# Altium schematic sheet NCS_Wireless_Control_Card_hc12_display_conn.SchDoc
size A
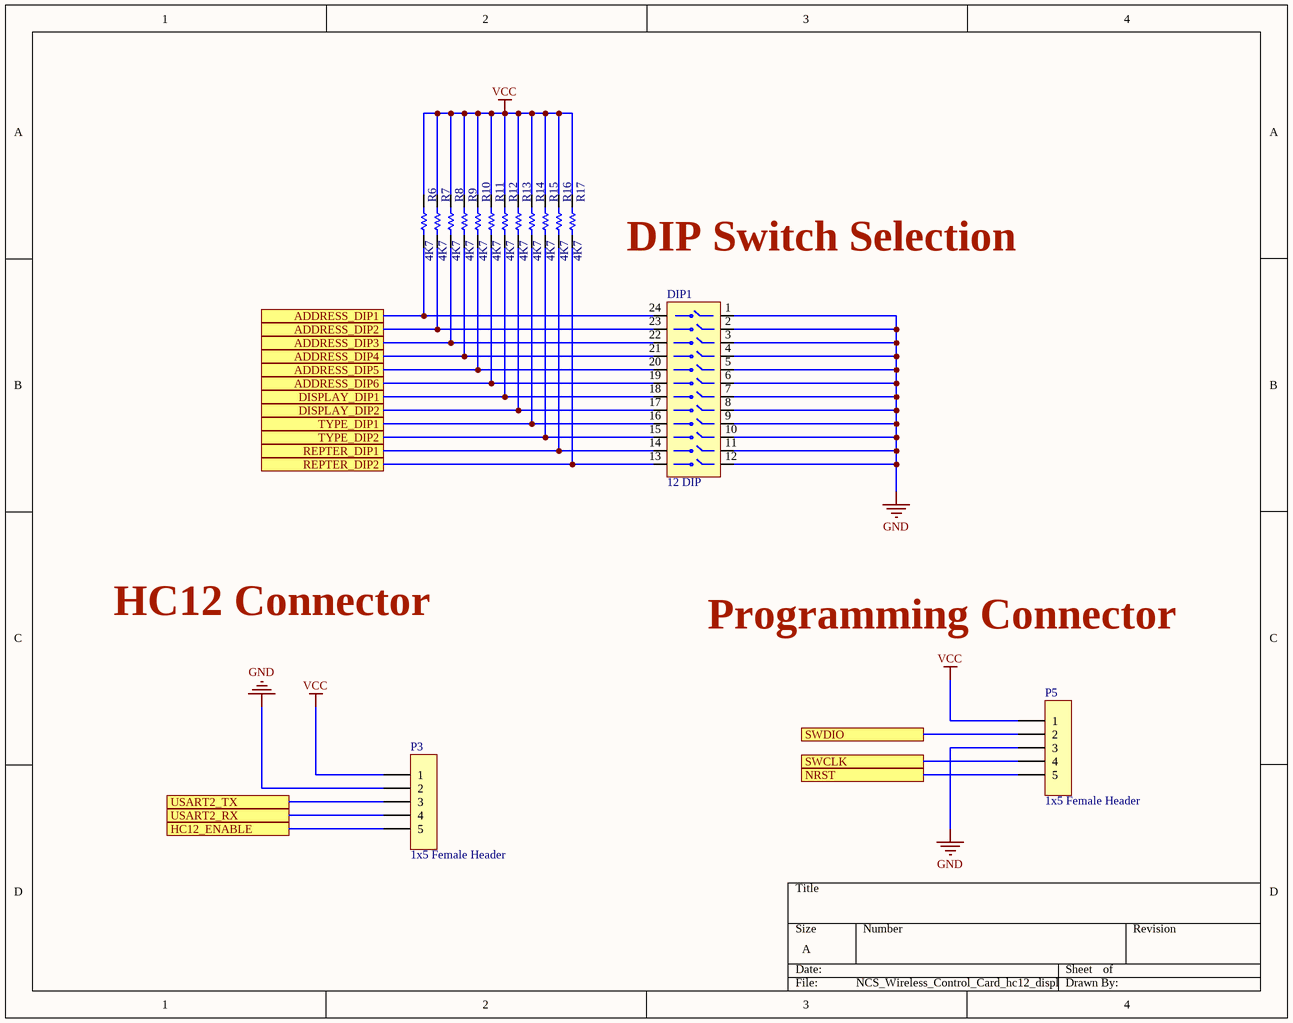
[diagram p0: NCS_Wireless_Control_Card_hc12_display_conn.SchDoc]

## Parts
DIP1  12 DIP  [DIP24]
P3  1x5 Female Header  [1x5 Female Header]
P5  1x5 Female Header  [1x5 Female Header]
R6  4K7  [RC0805FR-7W330RL]
R7  4K7  [RC0805FR-7W330RL]
R8  4K7  [RC0805FR-7W330RL]
R9  4K7  [RC0805FR-7W330RL]
R10  4K7  [RC0805FR-7W330RL]
R11  4K7  [RC0805FR-7W330RL]
R12  4K7  [RC0805FR-7W330RL]
R13  4K7  [RC0805FR-7W330RL]
R14  4K7  [RC0805FR-7W330RL]
R15  4K7  [RC0805FR-7W330RL]
R16  4K7  [RC0805FR-7W330RL]
R17  4K7  [RC0805FR-7W330RL]

## Ports
ADDRESS_DIP1, ADDRESS_DIP2, ADDRESS_DIP3, ADDRESS_DIP4, ADDRESS_DIP5, ADDRESS_DIP6, DISPLAY_DIP1, DISPLAY_DIP2, HC12_ENABLE, NRST, REPTER_DIP1, REPTER_DIP2, SWCLK, SWDIO, TYPE_DIP1, TYPE_DIP2, USART2_RX, USART2_TX

## Nets
GND: DIP1.1 DIP1.2 DIP1.3 DIP1.4 DIP1.5 DIP1.6 DIP1.7 DIP1.8 DIP1.9 DIP1.10 DIP1.11 DIP1.12 P3.2 P5.3
VCC: P3.1 P5.1 R6.2 R7.2 R8.2 R9.2 R10.2 R11.2 R12.2 R13.2 R14.2 R15.2 R16.2 R17.2
ADDRESS_DIP1: DIP1.24 R6.1 ; port ADDRESS_DIP1
ADDRESS_DIP2: DIP1.23 R7.1 ; port ADDRESS_DIP2
ADDRESS_DIP3: DIP1.22 R8.1 ; port ADDRESS_DIP3
ADDRESS_DIP4: DIP1.21 R9.1 ; port ADDRESS_DIP4
ADDRESS_DIP5: DIP1.20 R10.1 ; port ADDRESS_DIP5
ADDRESS_DIP6: DIP1.19 R11.1 ; port ADDRESS_DIP6
DISPLAY_DIP1: DIP1.18 R12.1 ; port DISPLAY_DIP1
DISPLAY_DIP2: DIP1.17 R13.1 ; port DISPLAY_DIP2
HC12_ENABLE: P3.5 ; port HC12_ENABLE
NRST: P5.5 ; port NRST
REPTER_DIP1: DIP1.14 R16.1 ; port REPTER_DIP1
REPTER_DIP2: DIP1.13 R17.1 ; port REPTER_DIP2
SWCLK: P5.4 ; port SWCLK
SWDIO: P5.2 ; port SWDIO
TYPE_DIP1: DIP1.16 R14.1 ; port TYPE_DIP1
TYPE_DIP2: DIP1.15 R15.1 ; port TYPE_DIP2
USART2_RX: P3.4 ; port USART2_RX
USART2_TX: P3.3 ; port USART2_TX

## Notes on the sheet
- DIP Switch Selection
- HC12 Connector
- Programming Connector

## Library data of the parts
DIP1 = 12 Way 2.54MM DIP switch - SUNROM
P3 P5 = M20-9990546: 2.54mm (0.1) Pitch SIL Vertical PC Tail Pin Header, 6.1mm mating pin height, tin, 5 contacts"; Manufacturer: Harwin; Number of Contacts: 5; Current Rating: 3A; Gender: Male; Insulation Resistance: 10GR; Voltage Rating (DC): 750V; Mated Stacking Heights: 16.54mm; Supplier: Digikey; Supplier Part Number: 952-2268-ND; Manufacturer Part Number: M20-9990546; RoHS: Yes; Category: Headers and Wire Housings; Stock: 16218; Pricing: 1=0.2, 10=0.163, 100=0.1329, 500=0.11516, 1000=0.10828, 5000=0.09388, 10000=0.08828 (USD); Mounting Technology: Through Hole; Case/Package: SIL; Contact Material: Brass,Bronze; Contact Plating: Tin; Contact Shape: Square; Contact Finish - Mating: TIN; Insulation Material: Nylon; Insulation Color: Black; Min Operating Temperature: -40°C; Max Operating Temperature: 105°C; Number of Rows: 1; Termination: Solder; Package Quantity: 1000; Packaging: Bulk; Number of Positions: 5; Orientation: Straight; Series: M20; Contact Type: Male Pin; Fastening Type: Pull; Pitch: 2.54mm; Reach SVHC Compliant: No; RoHS Compliant: Yes; Flammability Rating: UL94 V-0; ComponentLink1URL: https://datasheet.ciiva.com/11749/0900766b80da602d-11749062.pdf?src-supplier=Rs; ComponentLink1Description: https://datasheet.ciiva.com/11749/0900766b80da602d-11749062.pdf?src-supplier=Rs; ComponentLink2URL: https://datasheet.ciiva.com/6833/m20-999-6833320.pdf?src-supplier=Digikey; ComponentLink2Description: https://datasheet.ciiva.com/6833/m20-999-6833320.pdf?src-supplier=Digikey; ComponentLink3URL: https://datasheet.ciiva.com/8046/315376-8046940.pdf?src-supplier=Element14; ComponentLink3Description: https://datasheet.ciiva.com/8046/315376-8046940.pdf?src-supplier=Element14
R6-R17 = RC0805FR-7W330RL: Res Thick Film 0805 330 Ohm 1% 0.25W(1/4W) ±200ppm/C Pad SMD T/R; Manufacturer: Yageo; Value: 330R; Supplier: Digikey; Supplier Part Number: 13-RC0805FR-7W330RLCT-ND; Manufacturer Part Number: RC0805FR-7W330RL; RoHS: Yes; Category: Chip SMD Resistors; Stock: 5595; Pricing: 1=0.17, 10=0.057, 50=0.046, 100=0.0347, 500=0.03264, 1000=0.0306 (USD); Case/Package: 339Case; Packaging: 10Packaging